# Altium schematic sheet MCU.SchDoc
size A4
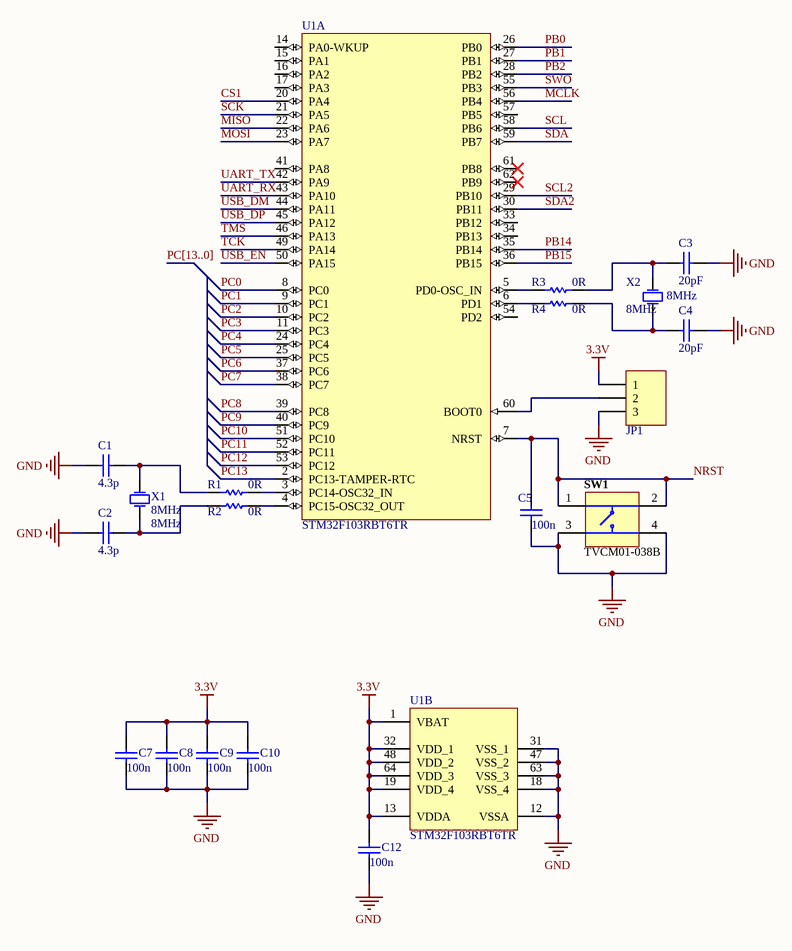
[diagram p0: MCU.SchDoc]

## Parts
C1  4.3p  [CAPC0603(1608)100_L]
C2  4.3p  [CAPC0603(1608)100_L]
C3  20pF  [CAPC0603(1608)100_L]
C4  20pF  [CAPC0603(1608)100_L]
C5  100n  [CAPC0603(1608)100_L]
C7  100n  [CAPC0603(1608)100_L]
C8  100n  [CAPC0603(1608)100_L]
C9  100n  [CAPC0603(1608)100_L]
C10  100n  [CAPC0603(1608)100_L]
C12  100n  [CAPC0603(1608)100_L]
JP1  HDR1X3  [HDR1X3]  (value not drawn)
R1  0R  [RESC0603(1608)_L]
R2  0R  [RESC0603(1608)_L]
R3  0R  [RESC0603(1608)_L]
R4  0R  [RESC0603(1608)_L]
SW1  TVCM01-038B  [JNFU-TVCM01-038B_V]
U1  STM32F103RBT6TR  [LQFP64_N]  (parts A,B of 2)
X1  8MHz  [HC49/4H_SMX]
X2  8MHz  [HC49/4H_SMX]

## Nets
3.3V: C7.2 C8.2 C9.2 C10.2 C12.2 JP1.1 U1.1(VBAT) U1.13(VDDA) U1.19(VDD_4) U1.32(VDD_1) U1.48(VDD_2) U1.64(VDD_3)
GND: C1.1 C2.1 C3.1 C4.1 C5.2 C7.1 C8.1 C9.1 C10.1 C12.1 JP1.3 SW1.3 SW1.4 U1.12(VSSA) U1.18(VSS_4) U1.31(VSS_1) U1.47(VSS_2) U1.63(VSS_3)
CS1: U1.20(PA4)
MCLK: U1.56(PB4)
MISO: U1.22(PA6)
MOSI: U1.23(PA7)
NRST: C5.1 SW1.1 SW1.2 U1.7(NRST)
PB0: U1.26(PB0)
PB1: U1.27(PB1)
PB2: U1.28(PB2)
PB14: U1.35(PB14)
PB15: U1.36(PB15)
PC0: U1.8(PC0)
PC1: U1.9(PC1)
PC2: U1.10(PC2)
PC3: U1.11(PC3)
PC4: U1.24(PC4)
PC5: U1.25(PC5)
PC6: U1.37(PC6)
PC7: U1.38(PC7)
PC8: U1.39(PC8)
PC9: U1.40(PC9)
PC10: U1.51(PC10)
PC11: U1.52(PC11)
PC12: U1.53(PC12)
PC13: U1.2(PC13-TAMPER-RTC)
SCK: U1.21(PA5)
SCL: U1.58(PB6)
SCL2: U1.29(PB10)
SDA: U1.59(PB7)
SDA2: U1.30(PB11)
SWO: U1.55(PB3)
TCK: U1.49(PA14)
TMS: U1.46(PA13)
UART_RX: U1.43(PA10)
UART_TX: U1.42(PA9)
USB_DM: U1.44(PA11)
USB_DP: U1.45(PA12)
USB_EN: U1.50(PA15)
NetC1_2: C1.2 R1.1 X1.2(OSC2)
NetC2_2: C2.2 R2.1 X1.1(OSC1)
NetC3_2: C3.2 R3.1 X2.1(OSC1)
NetC4_2: C4.2 R4.1 X2.2(OSC2)
NetJP1_2: JP1.2 U1.60(BOOT0)
NetR1_2: R1.2 U1.3(PC14-OSC32_IN)
NetR2_2: R2.2 U1.4(PC15-OSC32_OUT)
NetR3_2: R3.2 U1.5(PD0-OSC_IN)
NetR4_2: R4.2 U1.6(PD1)

Not connected (* = marked no-connect by the designer): U1 14(PA0-WKUP) 15(PA1) 16(PA2) 17(PA3) 33(PB12) 34(PB13) 41(PA8) 54(PD2) 57(PB5) 61(PB8)* 62(PB9)*

## Buses and harness runs
bus PC[13..0]

## Library data of the parts
C1-C5 C7-C10 C12 = CMP-1590-00005-1: 0603 (1608 Metric) Chip Capacitor; Case-Metric: 1608; Case-EIA: 0603; PackageReference: CAPC0603(1608)100
JP1 = HDR1X3: Header, 3-Pin; LatestRevisionDate: 17-Jul-2002; LatestRevisionNote: Re-released for DXP Platform.; Publisher: Altium Limited
R1-R4 = CMP-1591-00001-1: 0603 (1608 Metric) Chip Resistor; Case-Metric: 1608; Case-EIA: 0603; PackageReference: RESC0603(1608)
SW1 = CMP-0224-00001-1: Switch, Push Button, 50 mA, 12V DC, SMD; Mechanical Life: 100,000 cycles; PackageReference: TVCM01-038B; Operating Temperature: -30 to 85 degC; ComponentLink1URL: http://www.jian-fu.com/; ComponentLink2Description: Datasheet; Mounting Technology: Suface Mount; Case Size: 4.5 x 4.5; ComponentLink1Description: Manufacturer URL; PartNumber: TVCM01-038B; ComponentLink2URL: http://www.jian-fu.com/product-61.html; PackageDescription: 4-Pin Surface Mount Switch, 4.5 x 4.5 mm Body
U1 = CMP-0237-00169-1: STM32 ARM-based 32-bit MCU Performance Line with 128 kB Flash, 20 kB Internal RAM, -40 to +85°C Temperature, 64-Pin LQFP, Tape and Reel; ComponentLink1Description: STM32F103 Datasheet; DatasheetVersion: rev13.0, Apr-2011; ComponentLink2URL: www.st.com/stm32; ComponentLink1URL: http://www.st.com/internet/com/TECHNICAL_RESOURCES/TECHNICAL_LITERATURE/DATASHEET/CD00161566.pdf; PackageDescription: 64-Pin Low-Profile Quad Flat Pack, 10 x 10 mm Body, 0.5 mm Pitch (LQFP64); PackageVersion: rev13, Apr-2011; PackageReference: LQFP64; ComponentLink3Description: st.com Home; ComponentLink2Description: STM32 Family Web Page; ComponentLink3URL: http://www.st.com/internet/com/home/home.jsp
X1 X2 = XTAL: Oscillator; Unit Price1: *; Unit Price2: *; Value: 8MHz